# Altium project Power_battery.PrjPcb
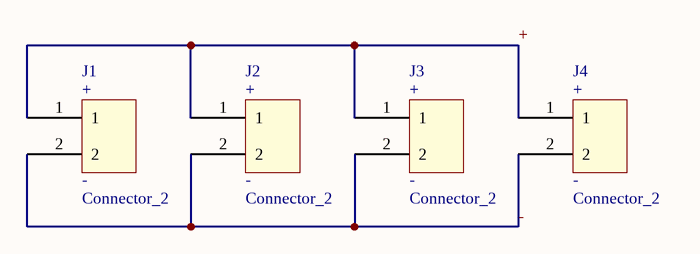
[diagram p0: Sheet1.SchDoc]
1 sheet, 4 parts. Net scope: global (net labels, ports and power ports of the same name join across sheets).
Board files: PCB1.PcbDoc, Panel.PcbDoc

## Sheet Sheet1.SchDoc
size A4; SheetNumber: 1; SheetTotal: 1

### Parts
J1  Connector_2  [PCBComponent_1]
J2  Connector_2  [PCBComponent_1]
J3  Connector_2  [PCBComponent_1]
J4  Connector_2  [XT60_FEMALE_PANEL]

### Nets
+: J1.1 J2.1 J3.1 J4.1
-: J1.2 J2.2 J3.2 J4.2

### Notes on the sheet
- (in symbol Connector_2) +; -